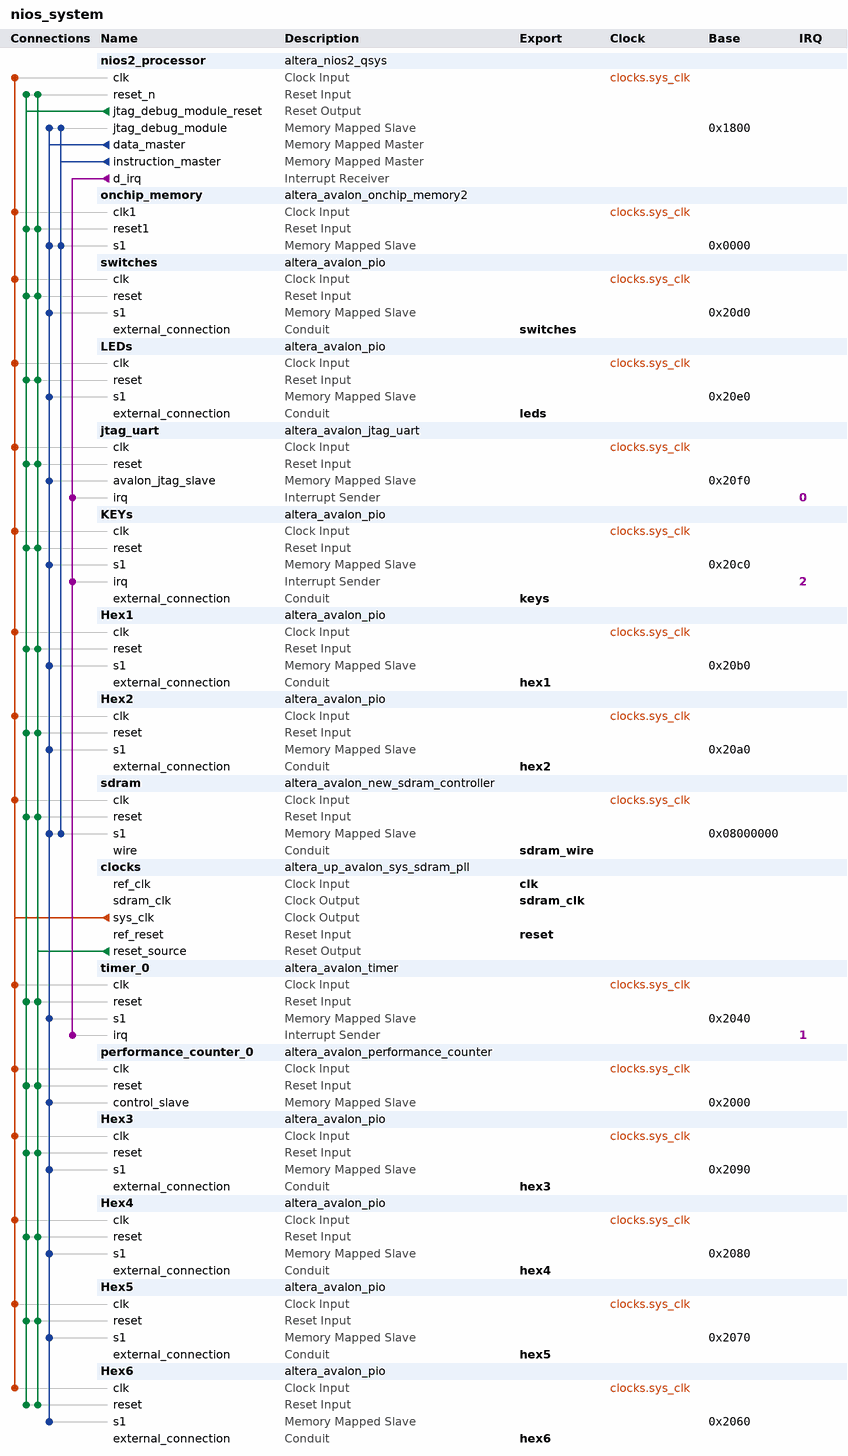
[diagram p0: system contents]
# Platform Designer (Qsys) system nios_system, Cyclone V 5CSEMA5F31C6
# Parameters at their usual value, and those the tool derives, are not listed.
package require -exact qsys 16.1
create_system nios_system
set_project_property DEVICE_FAMILY {Cyclone V}
set_project_property DEVICE 5CSEMA5F31C6

add_instance nios2_processor altera_nios2_qsys 16.1
set_instance_parameter_value nios2_processor breakSlave nios2_processor.jtag_debug_module
set_instance_parameter_value nios2_processor exceptionSlave sdram.s1
set_instance_parameter_value nios2_processor icache_size 4096
set_instance_parameter_value nios2_processor impl Tiny
set_instance_parameter_value nios2_processor mmu_TLBMissExcSlave None
set_instance_parameter_value nios2_processor resetSlave sdram.s1
set_instance_parameter_value nios2_processor resetrequest_enabled true

add_instance onchip_memory altera_avalon_onchip_memory2 16.1
set_instance_parameter_value onchip_memory dataWidth 32
set_instance_parameter_value onchip_memory dualPort false
set_instance_parameter_value onchip_memory initMemContent true
set_instance_parameter_value onchip_memory initializationFileName onchip_mem.hex
set_instance_parameter_value onchip_memory memorySize 4096

add_instance switches altera_avalon_pio 16.1
set_instance_parameter_value switches direction Input
set_instance_parameter_value switches width 8

add_instance LEDs altera_avalon_pio 16.1
set_instance_parameter_value LEDs direction Output
set_instance_parameter_value LEDs width 8

add_instance jtag_uart altera_avalon_jtag_uart 16.1
set_instance_parameter_value jtag_uart simInteractiveOptions NO_INTERACTIVE_WINDOWS

add_instance KEYs altera_avalon_pio 16.1
set_instance_parameter_value KEYs bitClearingEdgeCapReg true
set_instance_parameter_value KEYs captureEdge true
set_instance_parameter_value KEYs direction Input
set_instance_parameter_value KEYs edgeType FALLING
set_instance_parameter_value KEYs generateIRQ true
set_instance_parameter_value KEYs irqType EDGE
set_instance_parameter_value KEYs width 2

add_instance Hex1 altera_avalon_pio 16.1
set_instance_parameter_value Hex1 direction Output
set_instance_parameter_value Hex1 width 7

add_instance Hex2 altera_avalon_pio 16.1
set_instance_parameter_value Hex2 direction Output
set_instance_parameter_value Hex2 width 7

add_instance sdram altera_avalon_new_sdram_controller 16.1
set_instance_parameter_value sdram TAC 5.4
set_instance_parameter_value sdram TRCD 15.0
set_instance_parameter_value sdram TRP 15.0
set_instance_parameter_value sdram casLatency 3
set_instance_parameter_value sdram columnWidth 10
set_instance_parameter_value sdram dataWidth 16
set_instance_parameter_value sdram generateSimulationModel false
set_instance_parameter_value sdram model single_Micron_MT48LC4M32B2_7_chip
set_instance_parameter_value sdram numberOfBanks 4
set_instance_parameter_value sdram numberOfChipSelects 1
set_instance_parameter_value sdram powerUpDelay 100.0
set_instance_parameter_value sdram refreshPeriod 7.8125
set_instance_parameter_value sdram rowWidth 13

add_instance clocks altera_up_avalon_sys_sdram_pll 16.1
set_instance_parameter_value clocks CV_boards DE1-SoC
set_instance_parameter_value clocks gui_outclk 50.0
set_instance_parameter_value clocks gui_refclk 50.0

add_instance timer_0 altera_avalon_timer 16.1
set_instance_parameter_value timer_0 period 1
set_instance_parameter_value timer_0 periodUnits MSEC

add_instance performance_counter_0 altera_avalon_performance_counter 16.1
set_instance_parameter_value performance_counter_0 numberOfSections 3

add_instance Hex3 altera_avalon_pio 16.1
set_instance_parameter_value Hex3 direction Output
set_instance_parameter_value Hex3 width 7

add_instance Hex4 altera_avalon_pio 16.1
set_instance_parameter_value Hex4 direction Output
set_instance_parameter_value Hex4 width 7

add_instance Hex5 altera_avalon_pio 16.1
set_instance_parameter_value Hex5 direction Output
set_instance_parameter_value Hex5 width 7

add_instance Hex6 altera_avalon_pio 16.1
set_instance_parameter_value Hex6 direction Output
set_instance_parameter_value Hex6 width 7

# connections
add_connection clocks.sys_clk Hex1.clk clock
add_connection clocks.sys_clk Hex2.clk clock
add_connection clocks.sys_clk Hex3.clk clock
add_connection clocks.sys_clk Hex4.clk clock
add_connection clocks.sys_clk Hex5.clk clock
add_connection clocks.sys_clk Hex6.clk clock
add_connection clocks.sys_clk jtag_uart.clk clock
add_connection clocks.sys_clk KEYs.clk clock
add_connection clocks.sys_clk LEDs.clk clock
add_connection clocks.sys_clk nios2_processor.clk clock
add_connection clocks.sys_clk onchip_memory.clk1 clock
add_connection clocks.sys_clk performance_counter_0.clk clock
add_connection clocks.sys_clk sdram.clk clock
add_connection clocks.sys_clk switches.clk clock
add_connection clocks.sys_clk timer_0.clk clock
add_connection clocks.reset_source Hex1.reset reset
add_connection clocks.reset_source Hex2.reset reset
add_connection clocks.reset_source Hex3.reset reset
add_connection clocks.reset_source Hex4.reset reset
add_connection clocks.reset_source Hex5.reset reset
add_connection clocks.reset_source Hex6.reset reset
add_connection clocks.reset_source jtag_uart.reset reset
add_connection clocks.reset_source KEYs.reset reset
add_connection clocks.reset_source LEDs.reset reset
add_connection clocks.reset_source nios2_processor.reset_n reset
add_connection clocks.reset_source onchip_memory.reset1 reset
add_connection clocks.reset_source performance_counter_0.reset reset
add_connection clocks.reset_source sdram.reset reset
add_connection clocks.reset_source switches.reset reset
add_connection clocks.reset_source timer_0.reset reset
add_connection nios2_processor.jtag_debug_module_reset Hex1.reset reset
add_connection nios2_processor.jtag_debug_module_reset Hex2.reset reset
add_connection nios2_processor.jtag_debug_module_reset Hex3.reset reset
add_connection nios2_processor.jtag_debug_module_reset Hex4.reset reset
add_connection nios2_processor.jtag_debug_module_reset Hex5.reset reset
add_connection nios2_processor.jtag_debug_module_reset Hex6.reset reset
add_connection nios2_processor.jtag_debug_module_reset jtag_uart.reset reset
add_connection nios2_processor.jtag_debug_module_reset KEYs.reset reset
add_connection nios2_processor.jtag_debug_module_reset LEDs.reset reset
add_connection nios2_processor.jtag_debug_module_reset nios2_processor.reset_n reset
add_connection nios2_processor.jtag_debug_module_reset onchip_memory.reset1 reset
add_connection nios2_processor.jtag_debug_module_reset performance_counter_0.reset reset
add_connection nios2_processor.jtag_debug_module_reset sdram.reset reset
add_connection nios2_processor.jtag_debug_module_reset switches.reset reset
add_connection nios2_processor.jtag_debug_module_reset timer_0.reset reset
add_connection nios2_processor.data_master Hex1.s1 avalon
set_connection_parameter_value nios2_processor.data_master/Hex1.s1 baseAddress 0x20b0
add_connection nios2_processor.data_master Hex2.s1 avalon
set_connection_parameter_value nios2_processor.data_master/Hex2.s1 baseAddress 0x20a0
add_connection nios2_processor.data_master Hex3.s1 avalon
set_connection_parameter_value nios2_processor.data_master/Hex3.s1 baseAddress 0x2090
add_connection nios2_processor.data_master Hex4.s1 avalon
set_connection_parameter_value nios2_processor.data_master/Hex4.s1 baseAddress 0x2080
add_connection nios2_processor.data_master Hex5.s1 avalon
set_connection_parameter_value nios2_processor.data_master/Hex5.s1 baseAddress 0x2070
add_connection nios2_processor.data_master Hex6.s1 avalon
set_connection_parameter_value nios2_processor.data_master/Hex6.s1 baseAddress 0x2060
add_connection nios2_processor.data_master jtag_uart.avalon_jtag_slave avalon
set_connection_parameter_value nios2_processor.data_master/jtag_uart.avalon_jtag_slave baseAddress 0x20f0
add_connection nios2_processor.data_master KEYs.s1 avalon
set_connection_parameter_value nios2_processor.data_master/KEYs.s1 baseAddress 0x20c0
add_connection nios2_processor.data_master LEDs.s1 avalon
set_connection_parameter_value nios2_processor.data_master/LEDs.s1 baseAddress 0x20e0
add_connection nios2_processor.data_master nios2_processor.jtag_debug_module avalon
set_connection_parameter_value nios2_processor.data_master/nios2_processor.jtag_debug_module baseAddress 0x1800
add_connection nios2_processor.data_master onchip_memory.s1 avalon
set_connection_parameter_value nios2_processor.data_master/onchip_memory.s1 baseAddress 0x0000
add_connection nios2_processor.data_master performance_counter_0.control_slave avalon
set_connection_parameter_value nios2_processor.data_master/performance_counter_0.control_slave baseAddress 0x2000
add_connection nios2_processor.data_master sdram.s1 avalon
set_connection_parameter_value nios2_processor.data_master/sdram.s1 baseAddress 0x08000000
add_connection nios2_processor.data_master switches.s1 avalon
set_connection_parameter_value nios2_processor.data_master/switches.s1 baseAddress 0x20d0
add_connection nios2_processor.data_master timer_0.s1 avalon
set_connection_parameter_value nios2_processor.data_master/timer_0.s1 baseAddress 0x2040
add_connection nios2_processor.instruction_master nios2_processor.jtag_debug_module avalon
set_connection_parameter_value nios2_processor.instruction_master/nios2_processor.jtag_debug_module baseAddress 0x1800
add_connection nios2_processor.instruction_master onchip_memory.s1 avalon
set_connection_parameter_value nios2_processor.instruction_master/onchip_memory.s1 baseAddress 0x0000
add_connection nios2_processor.instruction_master sdram.s1 avalon
set_connection_parameter_value nios2_processor.instruction_master/sdram.s1 baseAddress 0x08000000
add_connection nios2_processor.d_irq jtag_uart.irq interrupt
set_connection_parameter_value nios2_processor.d_irq/jtag_uart.irq irqNumber 0
add_connection nios2_processor.d_irq KEYs.irq interrupt
set_connection_parameter_value nios2_processor.d_irq/KEYs.irq irqNumber 2
add_connection nios2_processor.d_irq timer_0.irq interrupt
set_connection_parameter_value nios2_processor.d_irq/timer_0.irq irqNumber 1

# exported interfaces
add_interface clk clock sink
set_interface_property clk EXPORT_OF clocks.ref_clk
add_interface hex1 conduit end
set_interface_property hex1 EXPORT_OF Hex1.external_connection
add_interface hex2 conduit end
set_interface_property hex2 EXPORT_OF Hex2.external_connection
add_interface hex3 conduit end
set_interface_property hex3 EXPORT_OF Hex3.external_connection
add_interface hex4 conduit end
set_interface_property hex4 EXPORT_OF Hex4.external_connection
add_interface hex5 conduit end
set_interface_property hex5 EXPORT_OF Hex5.external_connection
add_interface hex6 conduit end
set_interface_property hex6 EXPORT_OF Hex6.external_connection
add_interface keys conduit end
set_interface_property keys EXPORT_OF KEYs.external_connection
add_interface leds conduit end
set_interface_property leds EXPORT_OF LEDs.external_connection
add_interface reset reset sink
set_interface_property reset EXPORT_OF clocks.ref_reset
add_interface sdram_clk clock source
set_interface_property sdram_clk EXPORT_OF clocks.sdram_clk
add_interface sdram_wire conduit end
set_interface_property sdram_wire EXPORT_OF sdram.wire
add_interface switches conduit end
set_interface_property switches EXPORT_OF switches.external_connection

set_interconnect_requirement {$system} qsys_mm.clockCrossingAdapter HANDSHAKE
set_interconnect_requirement {$system} qsys_mm.enableEccProtection FALSE
set_interconnect_requirement {$system} qsys_mm.insertDefaultSlave FALSE
set_interconnect_requirement {$system} qsys_mm.maxAdditionalLatency 1

save_system nios_system.qsys
